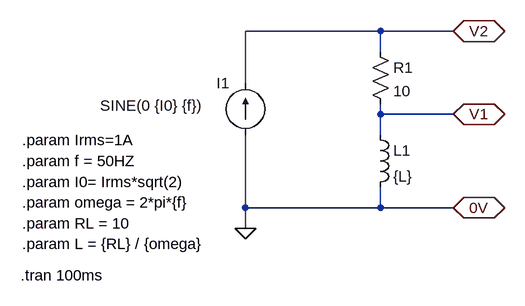
[diagram p0: schematic RL_Power_V001.asc]
RL_Power_V001.asc, the LTspice schematic file:
Version 4
SHEET 1 880 680
WIRE 208 32 0 32
WIRE 320 32 208 32
WIRE 208 64 208 32
WIRE 0 112 0 32
WIRE 208 160 208 144
WIRE 320 160 208 160
WIRE 208 192 208 160
WIRE 0 304 0 192
WIRE 208 304 208 272
WIRE 208 304 0 304
WIRE 320 304 208 304
WIRE 0 336 0 304
FLAG 0 336 0
FLAG 320 32 V2
IOPIN 320 32 BiDir
FLAG 320 160 V1
IOPIN 320 160 BiDir
FLAG 320 304 0V
IOPIN 320 304 BiDir
SYMBOL ind 192 176 R0
SYMATTR InstName L1
SYMATTR Value {L}
SYMBOL res 192 48 R0
SYMATTR InstName R1
SYMATTR Value 10
SYMBOL current 0 192 R180
WINDOW 0 24 80 Left 2
WINDOW 3 65 45 Left 2
WINDOW 123 0 0 Left 0
WINDOW 39 0 0 Left 0
SYMATTR InstName I1
SYMATTR Value SINE(0 {I0} {f})
TEXT -344 264 Left 2 !.param I0= Irms*sqrt(2)
TEXT -346 408 Left 2 !.tran 100ms
TEXT -344 200 Left 2 !.param Irms=1A
TEXT -344 232 Left 2 !.param f = 50HZ
TEXT -344 296 Left 2 !.param omega = 2*pi*{f}
TEXT -344 328 Left 2 !.param RL = 10
TEXT -344 360 Left 2 !.param L = {RL} / {omega}

The netlist it stands for:
* RL_Power_V001.asc
L1 V1 0 {L}
R1 V2 V1 10
I1 0 V2 SINE(0 {I0} {f})
.param I0= Irms*sqrt(2)
.tran 100ms
.param Irms=1A
.param f = 50HZ
.param omega = 2*pi*{f}
.param RL = 10
.param L = {RL} / {omega}
.backanno
.end

* Results of the author's LTspice run, read from the files saved beside the schematic
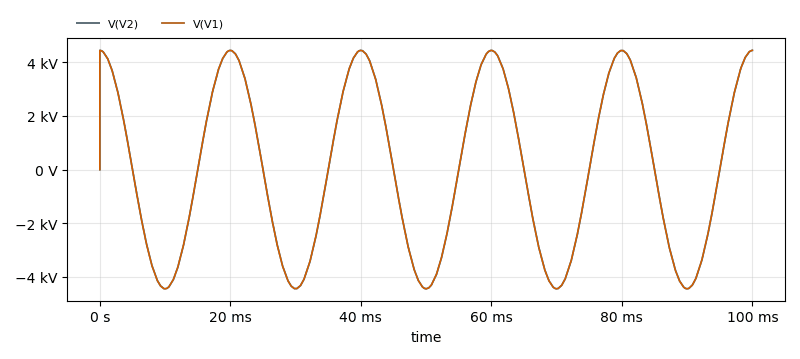
[diagram p1: Transient Analysis of RL_Power_V001.asc, plotted from the saved traces]
* Transient Analysis, 1 run:
*   V(V2): min -4.442 kV, max 4.443 kV, average -36.42 mV, rms 3.141 kV, last 4.443 kV
*   V(V1): min -4.442 kV, max 4.443 kV, average -36.53 mV, rms 3.141 kV, last 4.443 kV